# EAGLE schematic boardweeny-shield-adapter (EAGLE 5.10)
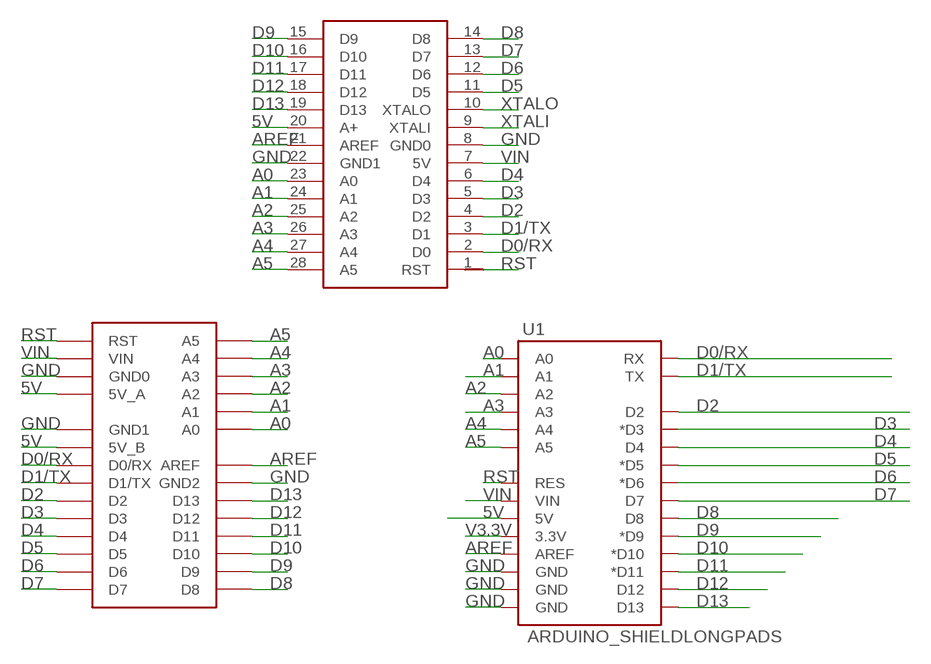
[diagram p0: schematic, sheet 1]

## Parts
U1  ARDUINO_SHIELDLONGPADS  [DUEMILANOVE_SHIELD_LONGPADS]
U$1  BOARDUINO  [BOARDUINO]
U$2  ARDWEENY  [DIL28-3]

## Nets
5V: U1.5V U$1.P$5(5V_A) U$1.P$7(5V_B) U$2.20(A+)
A0: U1.A0 U$1.P$24(A0) U$2.23(A0)
A1: U1.A1 U$1.P$25(A1) U$2.24(A1)
A2: U1.A2 U$1.P$26(A2) U$2.25(A2)
A3: U1.A3 U$1.P$27(A3) U$2.26(A3)
A4: U1.A4 U$1.P$28(A4) U$2.27(A4)
A5: U1.A5 U$1.P$29(A5) U$2.28(A5)
AREF: U1.AREF U$1.P$23(AREF) U$2.21(AREF)
D0/RX: U1.RX U$1.P$8(D0/RX) U$2.2(D0)
D1/TX: U1.TX U$1.P$9(D1/TX) U$2.3(D1)
D2: U1.D2 U$1.P$10(D2) U$2.4(D2)
D3: U1.D3(*D3) U$1.P$11(D3) U$2.5(D3)
D4: U1.D4 U$1.P$12(D4) U$2.6(D4)
D5: U1.D5(*D5) U$1.P$13(D5) U$2.11(D5)
D6: U1.D6(*D6) U$1.P$14(D6) U$2.12(D6)
D7: U1.D7 U$1.P$15(D7) U$2.13(D7)
D8: U1.D8 U$1.P$16(D8) U$2.14(D8)
D9: U1.D9(*D9) U$1.P$17(D9) U$2.15(D9)
D10: U1.D10(*D10) U$1.P$18(D10) U$2.16(D10)
D11: U1.D11(*D11) U$1.P$19(D11) U$2.17(D11)
D12: U1.D12 U$1.P$20(D12) U$2.18(D12)
D13: U1.D13 U$1.P$21(D13) U$2.19(D13)
GND: U1.GND@0(GND) U1.GND@1(GND) U1.GND@2(GND) U$1.P$4(GND0) U$1.P$6(GND1) U$1.P$22(GND2) U$2.8(GND0) U$2.22(GND1)
RST: U1.RES U$1.P$2(RST) U$2.1(RST)
V3.3V: U1.3.3V
VIN: U1.VIN U$1.P$3(VIN) U$2.7(5V)
XTALI: U$2.9(XTALI)
XTALO: U$2.10(XTALO)

## Library data of the parts
U1 = SparkFun:ARDUINO_SHIELD
U$1 = ideabot:BOARDUINO
U$2 = ideabot:ARDWEENY